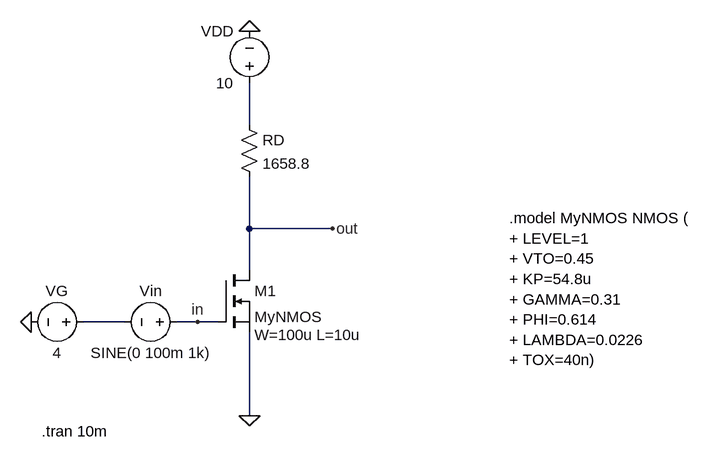
[diagram p0: schematic CS_Amp.asc]
CS_Amp.asc, the LTspice schematic file:
Version 4.1
SHEET 1 880 680
WIRE -144 -128 -144 -192
WIRE -144 32 -144 -48
WIRE -16 32 -144 32
WIRE -144 96 -144 32
WIRE -336 176 -400 176
WIRE -224 176 -256 176
WIRE -192 176 -224 176
WIRE -144 320 -144 192
FLAG -480 176 0
FLAG -144 -272 0
FLAG -16 32 out
FLAG -144 320 0
FLAG -224 176 in
SYMBOL nmos -192 96 R0
WINDOW 39 56 100 Left 2
SYMATTR InstName M1
SYMATTR Value MyNMOS
SYMATTR SpiceLine W=100u L=10u
SYMBOL voltage -240 176 R90
WINDOW 0 -32 56 VBottom 2
WINDOW 3 32 56 VTop 2
WINDOW 123 0 0 Left 0
WINDOW 39 0 0 Left 0
SYMATTR InstName Vin
SYMATTR Value SINE(0 100m 1k)
SYMBOL voltage -144 -176 R180
WINDOW 0 24 96 Left 2
WINDOW 3 24 16 Left 2
WINDOW 123 0 0 Left 0
WINDOW 39 0 0 Left 0
SYMATTR InstName VDD
SYMATTR Value 10
SYMBOL res -160 -144 R0
SYMATTR InstName RD
SYMATTR Value 1658.8
SYMBOL voltage -384 176 R90
WINDOW 0 -32 56 VBottom 2
WINDOW 3 32 56 VTop 2
WINDOW 123 0 0 Left 0
WINDOW 39 0 0 Left 0
SYMATTR InstName VG
SYMATTR Value 4
TEXT 256 16 Left 2 !.model MyNMOS NMOS (\n+ LEVEL=1\n+ VTO=0.45\n+ KP=54.8u\n+ GAMMA=0.31\n+ PHI=0.614\n+ LAMBDA=0.0226\n+ TOX=40n)
TEXT -464 344 Left 2 !.tran 10m

The netlist it stands for:
* CS_Amp.asc
M1 out in 0 0 MyNMOS W=100u L=10u
Vin in N002 SINE(0 100m 1k)
VDD N001 0 10
RD N001 out 1658.8
VG N002 0 4
.model NMOS NMOS
.model PMOS PMOS
.lib standard.mos
.model MyNMOS NMOS (
+ LEVEL=1
+ VTO=0.45
+ KP=54.8u
+ GAMMA=0.31
+ PHI=0.614
+ LAMBDA=0.0226
+ TOX=40n)
.tran 10m
.backanno
.end